# EAGLE schematic Audio_Board_REV_A (EAGLE 9.6.2)
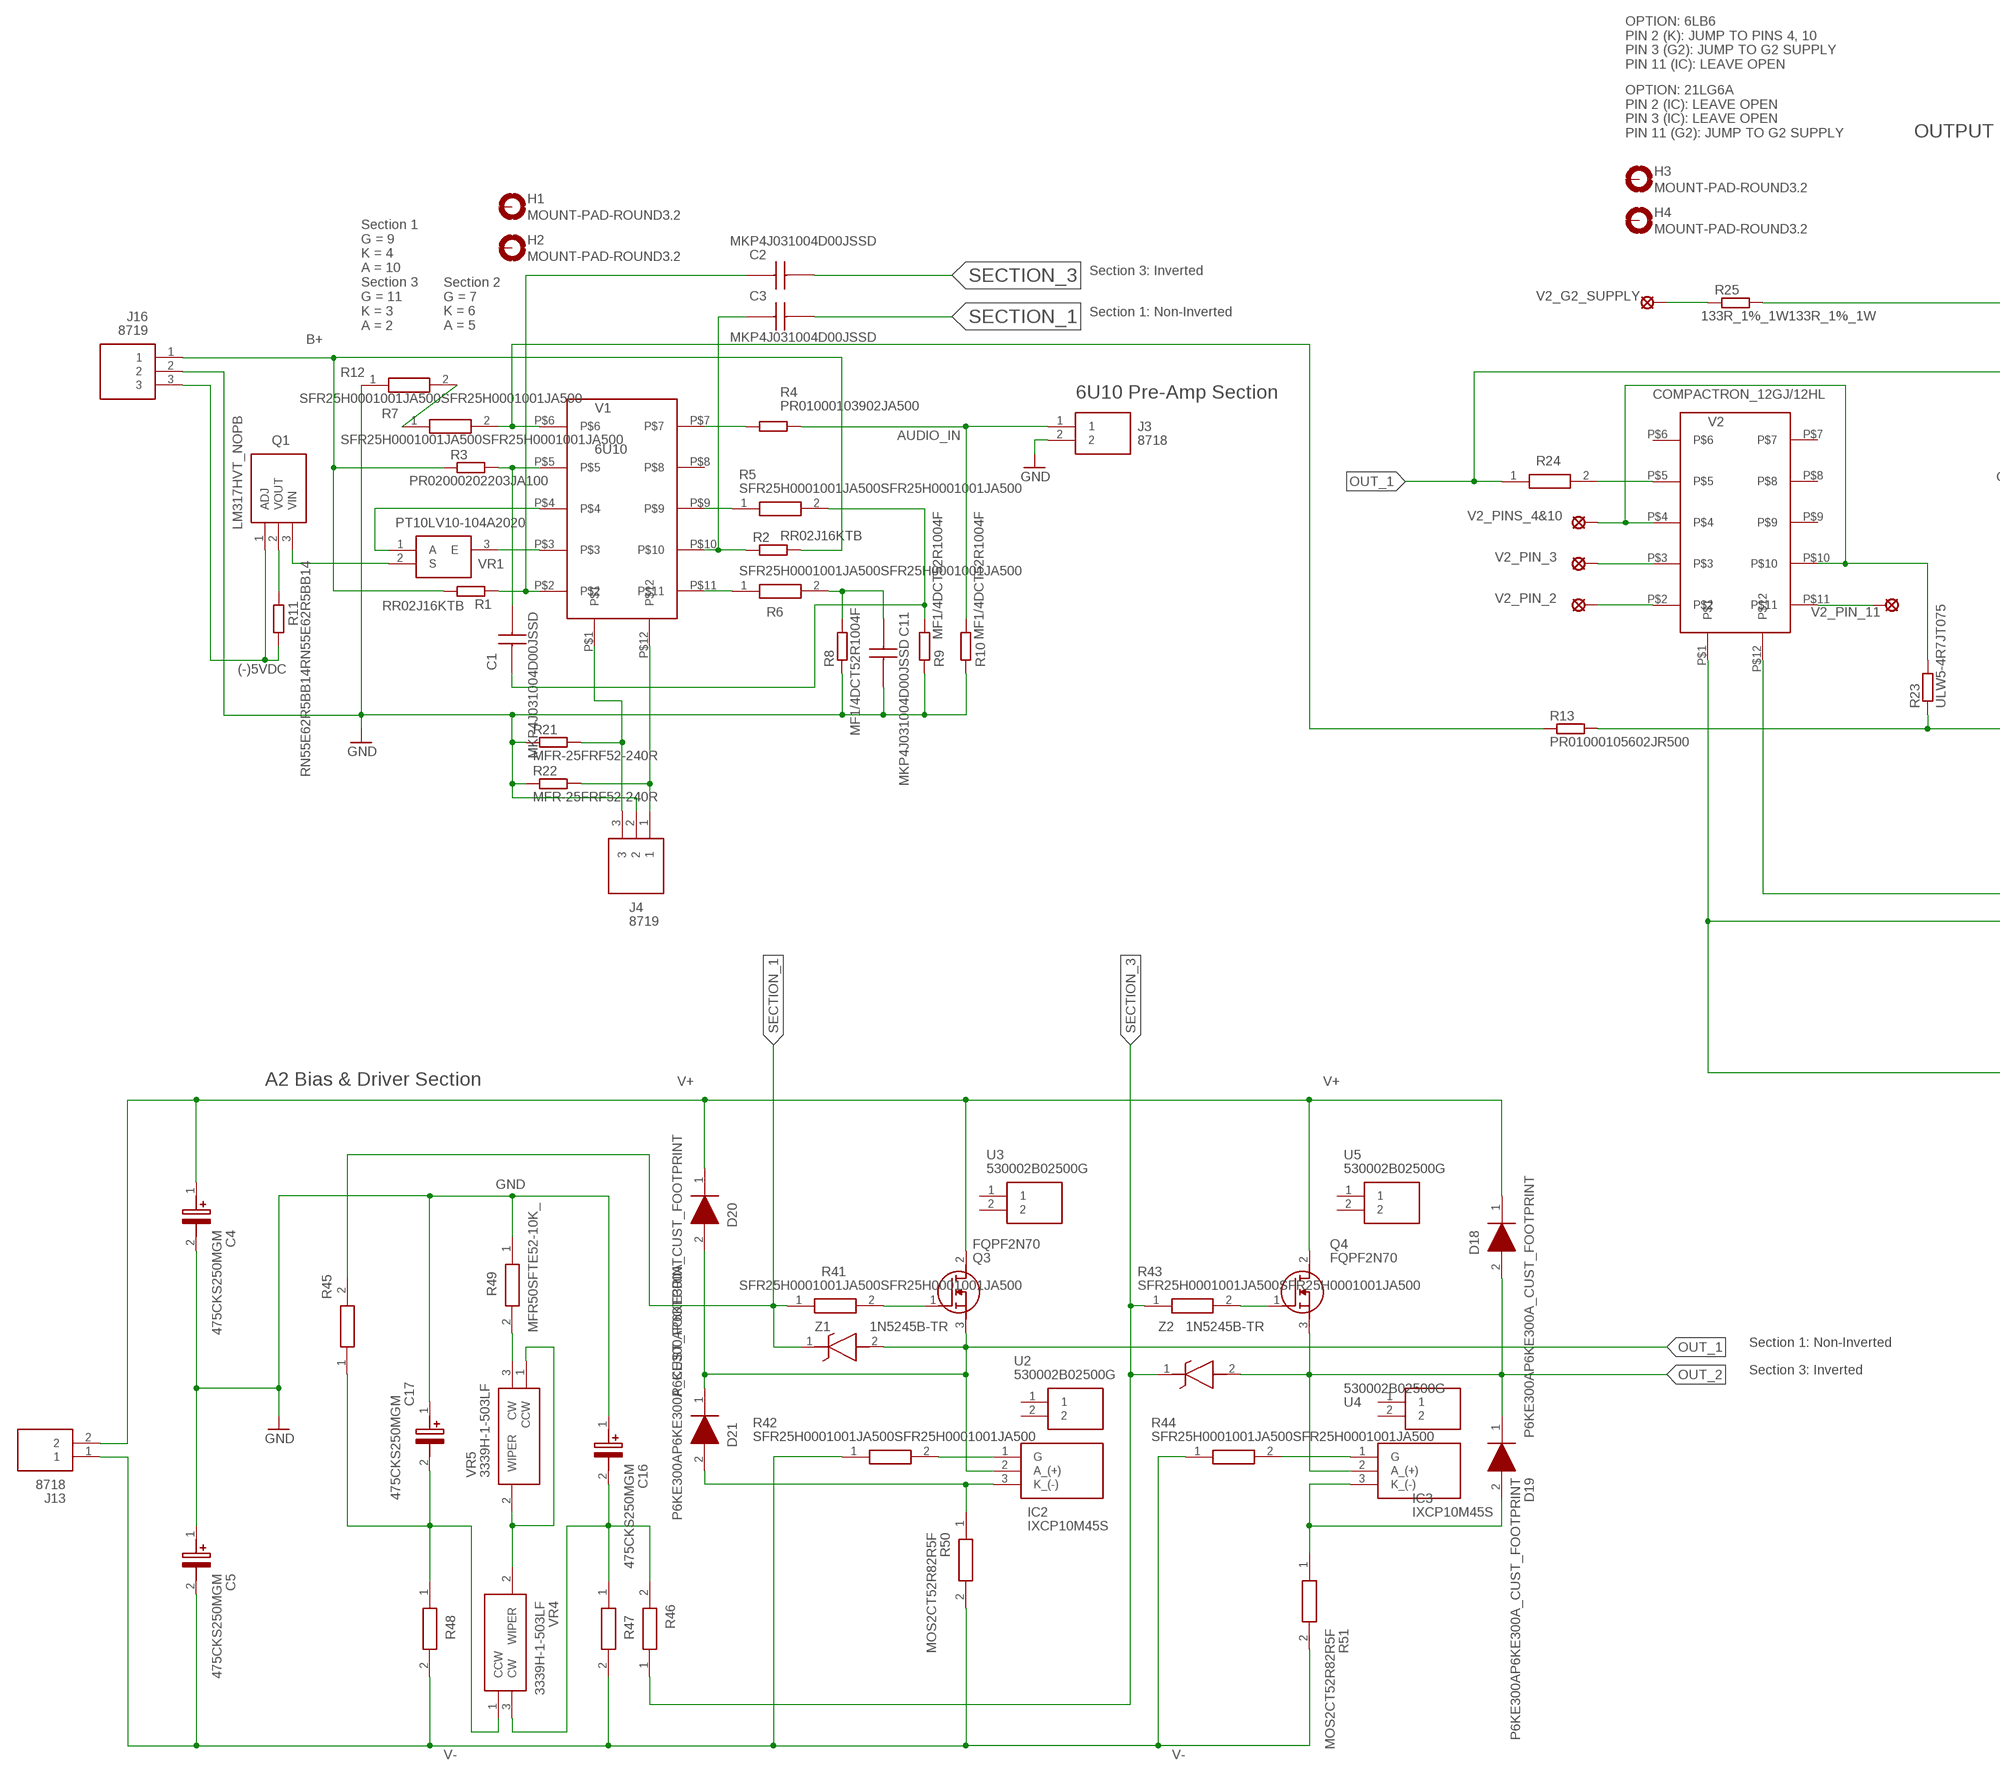
[diagram p0: schematic, sheet 1, part 1 of 2]
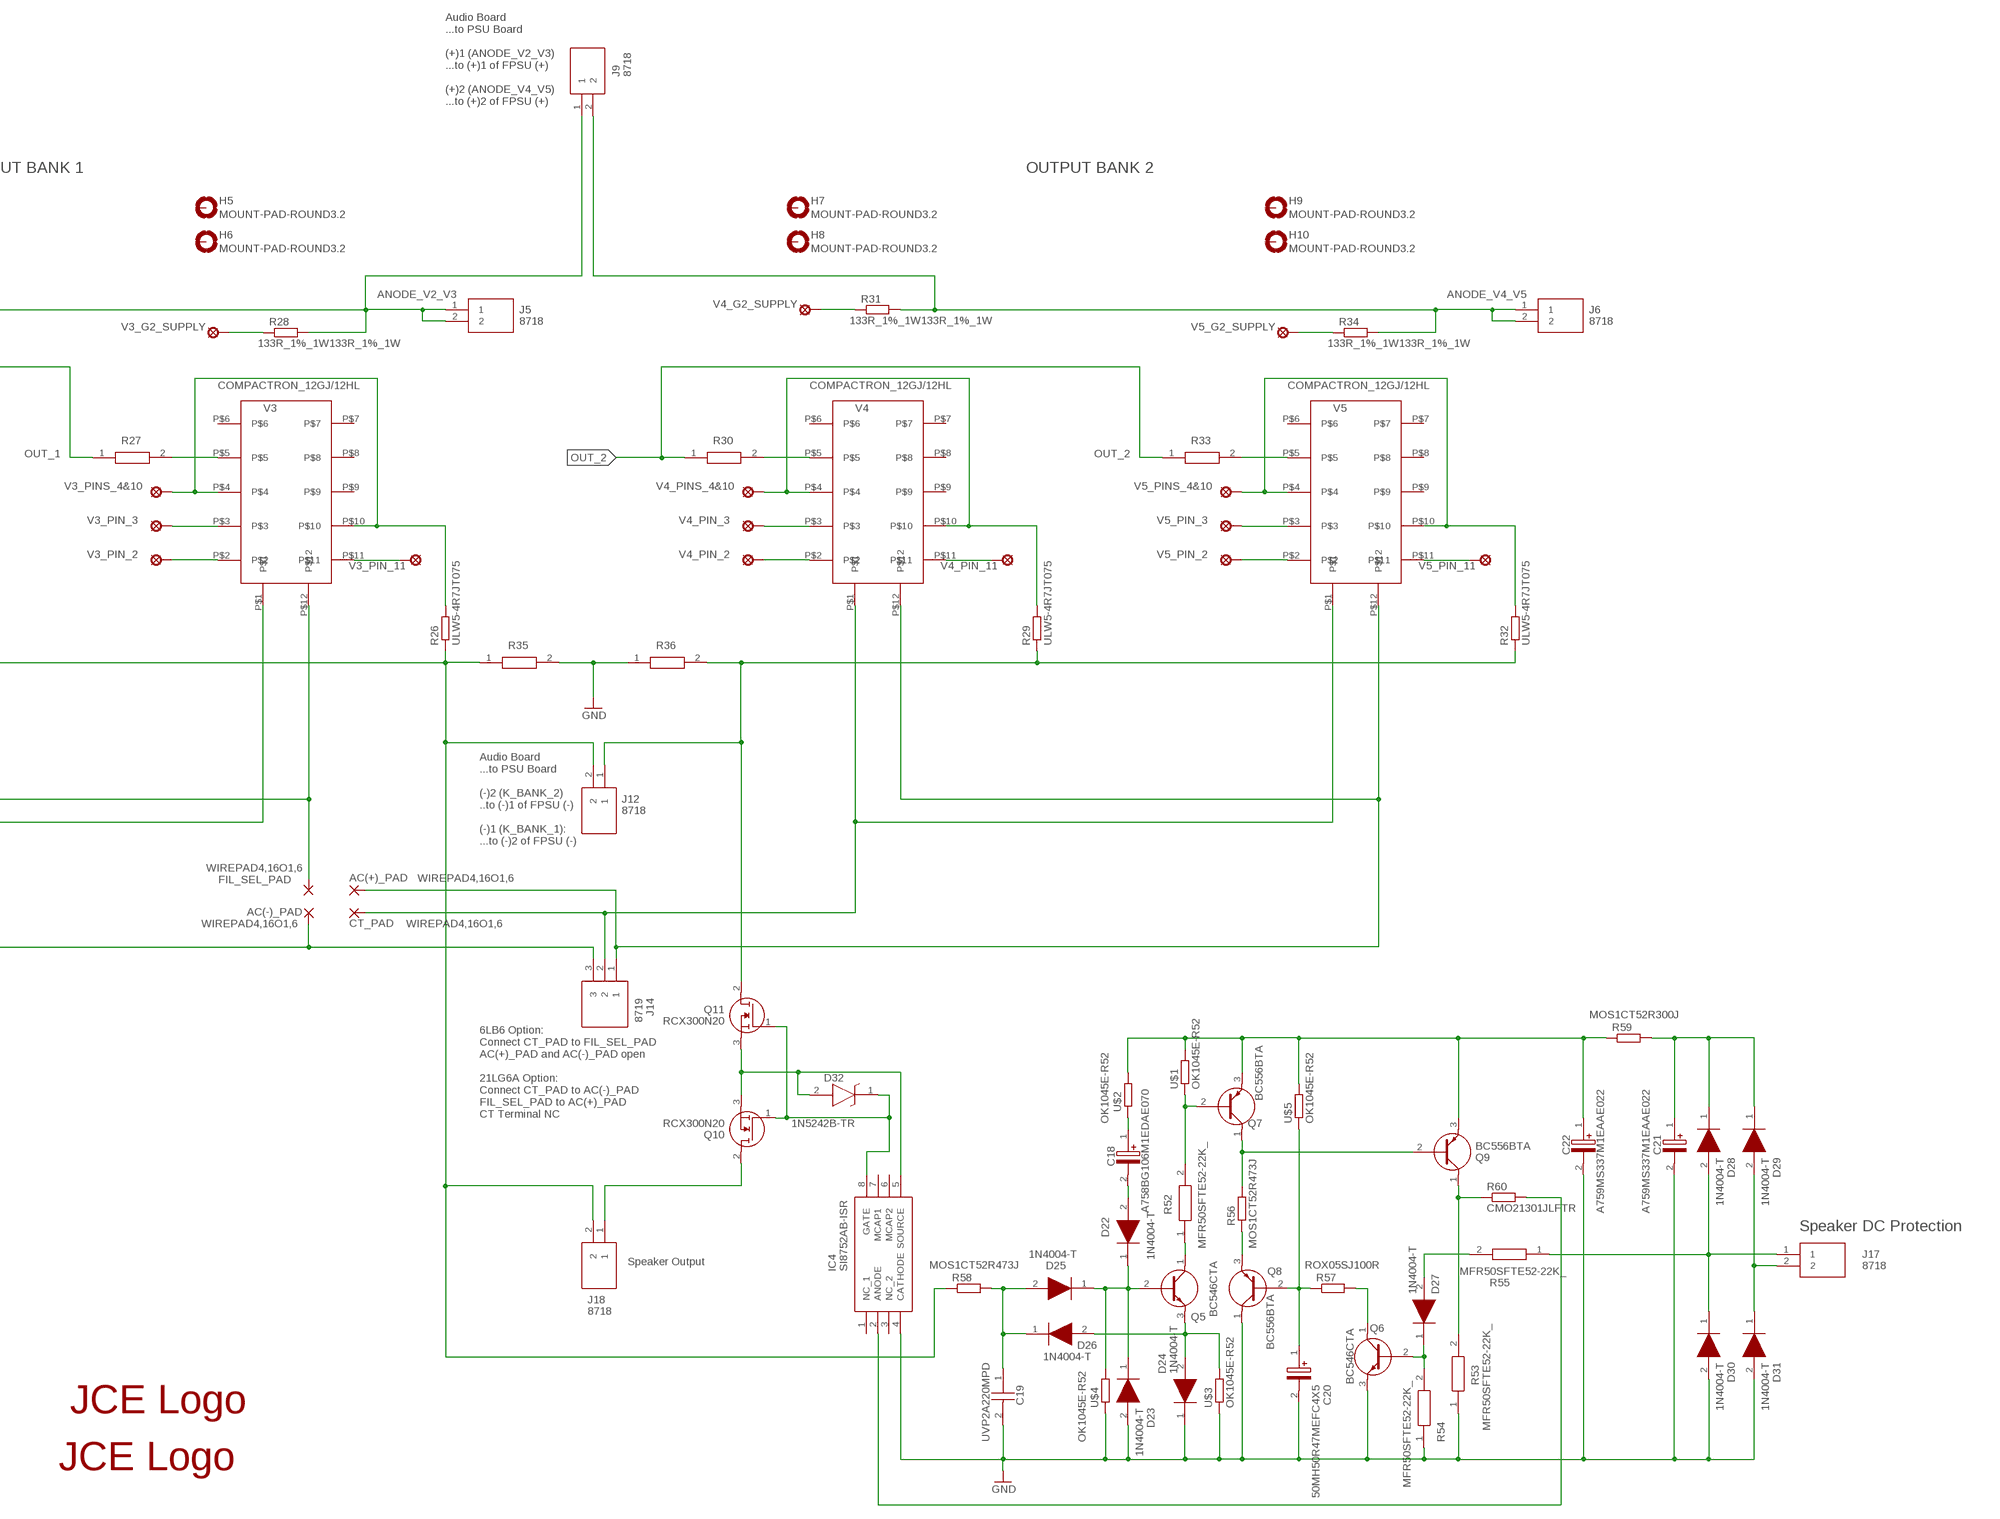
[diagram p1: schematic, sheet 1, part 2 of 2]

## Parts
AC(+)_PAD  WIREPAD4,16O1,6  [4,16O1,6]
AC(-)_PAD  WIREPAD4,16O1,6  [4,16O1,6]
C1  MKP4J031004D00JSSD  [MKP4J031004D00_]
C2  MKP4J031004D00JSSD  [MKP4J031004D00_]
C3  MKP4J031004D00JSSD  [MKP4J031004D00_]
C4  475CKS250MGM  [CAPPRD250W55D655H1250]
C5  475CKS250MGM  [CAPPRD250W55D655H1250]
C11  MKP4J031004D00JSSD  [MKP4J031004D00_]
C16  475CKS250MGM  [CAPPRD250W55D655H1250]
C17  475CKS250MGM  [CAPPRD250W55D655H1250]
C18  A758BG106M1EDAE070  [CAPPRD200W55D500H800]
C19  UVP2A220MPD  [CAPPRD500W60D1025H1750]
C20  50MH50R47MEFC4X5  [CAPPRD150W45D425H650]
C21  A759MS337M1EAAE022  [CAPPRD500W65D1000H1300]
C22  A759MS337M1EAAE022  [CAPPRD500W65D1000H1300]
CT_PAD  WIREPAD4,16O1,6  [4,16O1,6]
D18  P6KE300AP6KE300A_CUST_FOOTPRINT  [DIOAD1299W88L640D324B]
D19  P6KE300AP6KE300A_CUST_FOOTPRINT  [DIOAD1299W88L640D324B]
D20  P6KE300AP6KE300A_CUST_FOOTPRINT  [DIOAD1299W88L640D324B]
D21  P6KE300AP6KE300A_CUST_FOOTPRINT  [DIOAD1299W88L640D324B]
D22  1N4004-T  [DIOAD1408W86L464D236]
D23  1N4004-T  [DIOAD1408W86L464D236]
D24  1N4004-T  [DIOAD1408W86L464D236]
D25  1N4004-T  [DIOAD1408W86L464D236]
D26  1N4004-T  [DIOAD1408W86L464D236]
D27  1N4004-T  [DIOAD1408W86L464D236]
D28  1N4004-T  [DIOAD1408W86L464D236]
D29  1N4004-T  [DIOAD1408W86L464D236]
D30  1N4004-T  [DIOAD1408W86L464D236]
D31  1N4004-T  [DIOAD1408W86L464D236]
D32  1N5242B-TR  [DIOAD700W55L350D160B]
FIL_SEL_PAD  WIREPAD4,16O1,6  [4,16O1,6]
H1  MOUNT-PAD-ROUND3.2  [3,2-PAD]
H2  MOUNT-PAD-ROUND3.2  [3,2-PAD]
H3  MOUNT-PAD-ROUND3.2  [3,2-PAD]
H4  MOUNT-PAD-ROUND3.2  [3,2-PAD]
H5  MOUNT-PAD-ROUND3.2  [3,2-PAD]
H6  MOUNT-PAD-ROUND3.2  [3,2-PAD]
H7  MOUNT-PAD-ROUND3.2  [3,2-PAD]
H8  MOUNT-PAD-ROUND3.2  [3,2-PAD]
H9  MOUNT-PAD-ROUND3.2  [3,2-PAD]
H10  MOUNT-PAD-ROUND3.2  [3,2-PAD]
IC2  IXCP10M45S  [TO254P482X1016X2386-3P]
IC3  IXCP10M45S  [TO254P482X1016X2386-3P]
IC4  SI8752AB-ISR  [SOIC127P600X175-8N]
J3  8718  [SHDR2W99P0X500_1X2_1001X762X10]
J4  8719  [8719]
J5  8718  [SHDR2W99P0X500_1X2_1001X762X10]
J6  8718  [SHDR2W99P0X500_1X2_1001X762X10]
J9  8718  [SHDR2W99P0X500_1X2_1001X762X10]
J12  8718  [SHDR2W99P0X500_1X2_1001X762X10]
J13  8718  [SHDR2W99P0X500_1X2_1001X762X10]
J14  8719  [8719]
J16  8719  [8719]
J17  8718  [SHDR2W99P0X500_1X2_1001X762X10]
J18  8718  [SHDR2W99P0X500_1X2_1001X762X10]
Q1  LM317HVT_NOPB  [TO254P470X1028X1955-3P]
Q3  FQPF2N70  [TO254P490X1016X1977-3P]
Q4  FQPF2N70  [TO254P490X1016X1977-3P]
Q5  BC546CTA  [KA431AZTA]
Q6  BC546CTA  [KA431AZTA]
Q7  BC556BTA  [BC33740TA]
Q8  BC556BTA  [BC33740TA]
Q9  BC556BTA  [BC33740TA]
Q10  RCX300N20  [TO254P480X1010X1760-3P]
Q11  RCX300N20  [TO254P480X1010X1760-3P]
R1  RR02J16KTB  [RESAD1630W90L900D350B]
R2  RR02J16KTB  [RESAD1630W90L900D350B]
R3  PR02000202203JA100  [RESAD1809W83L1100D390B]
R4  PR01000103902JA500  [RESAD976W63L650D250B]
R5  SFR25H0001001JA500SFR25H0001001JA500  [RESAD1076W63L700D250B]
R6  SFR25H0001001JA500SFR25H0001001JA500  [RESAD1076W63L700D250B]
R7  SFR25H0001001JA500SFR25H0001001JA500  [RESAD1076W63L700D250B]
R8  MF1/4DCT52R1004F  [RESAD1000W60L630D230B]
R9  MF1/4DCT52R1004F  [RESAD1000W60L630D230B]
R10  MF1/4DCT52R1004F  [RESAD1000W60L630D230B]
R11  RN55E62R5BB14RN55E62R5BB14  [RESAD999W69L610D240B]
R12  SFR25H0001001JA500SFR25H0001001JA500  [RESAD1076W63L700D250B]
R13  PR01000105602JR500  [RESAD976W63L650D250B]
R21  MFR-25FRF52-240R  [RESAD1000W60L630D230B]
R22  MFR-25FRF52-240R  [RESAD1000W60L630D230B]
R23  ULW5-4R7JT075  [RESAD2010W80L1650D720B]
R24  SFR25H0001001JA500SFR25H0001001JA500  [RESAD1076W63L700D250B]
R25  133R_1%_1W133R_1%_1W  [RESAD1560W50L1230D250B]
R26  ULW5-4R7JT075  [RESAD2010W80L1650D720B]
R27  SFR25H0001001JA500SFR25H0001001JA500  [RESAD1076W63L700D250B]
R28  133R_1%_1W133R_1%_1W  [RESAD1560W50L1230D250B]
R29  ULW5-4R7JT075  [RESAD2010W80L1650D720B]
R30  SFR25H0001001JA500SFR25H0001001JA500  [RESAD1076W63L700D250B]
R31  133R_1%_1W133R_1%_1W  [RESAD1560W50L1230D250B]
R32  ULW5-4R7JT075  [RESAD2010W80L1650D720B]
R33  SFR25H0001001JA500SFR25H0001001JA500  [RESAD1076W63L700D250B]
R34  133R_1%_1W133R_1%_1W  [RESAD1560W50L1230D250B]
R35  SFR25H0001001JA500SFR25H0001001JA500  [RESAD1076W63L700D250B]
R36  SFR25H0001001JA500SFR25H0001001JA500  [RESAD1076W63L700D250B]
R41  SFR25H0001001JA500SFR25H0001001JA500  [RESAD1076W63L700D250B]
R42  SFR25H0001001JA500SFR25H0001001JA500  [RESAD1076W63L700D250B]
R43  SFR25H0001001JA500SFR25H0001001JA500  [RESAD1076W63L700D250B]
R44  SFR25H0001001JA500SFR25H0001001JA500  [RESAD1076W63L700D250B]
R45  MFR50SFTE52-220K_  [RESAD1276W63L900D330B]
R46  MFR50SFTE52-220K_  [RESAD1276W63L900D330B]
R47  MFR50SFTE52-220K_  [RESAD1276W63L900D330B]
R48  MFR50SFTE52-220K_  [RESAD1276W63L900D330B]
R49  MFR50SFTE52-10K_  [RESAD1276W63L900D330B]
R50  MOS2CT52R82R5F  [RESAD1660W80L1200D400B]
R51  MOS2CT52R82R5F  [RESAD1660W80L1200D400B]
R52  MFR50SFTE52-22K_  [RESAD1276W63L900D330B]
R53  MFR50SFTE52-22K_  [RESAD1276W63L900D330B]
R54  MFR50SFTE52-22K_  [RESAD1276W63L900D330B]
R55  MFR50SFTE52-22K_  [RESAD1276W63L900D330B]
R56  MOS1CT52R473J  [RESAD1360W80L900D300B]
R57  ROX05SJ100R  [RESAD1350W75L1000D350B]
R58  MOS1CT52R473J  [RESAD1360W80L900D300B]
R59  MOS1CT52R300J  [RESAD1360W80L900D300B]
R60  CMO21301JLFTR  [ON1045E-R58]
SYM1  JCE_SMALLSMALL  [JCE_SMALL]
SYM2  JCE_SMALL  [JCE]
U2  530002B02500G  [529802B02500G]
U3  530002B02500G  [529802B02500G]
U4  530002B02500G  [529802B02500G]
U5  530002B02500G  [529802B02500G]
U$1  OK1045E-R52  [RESAD1020W70L680D250B]
U$2  OK1045E-R52  [RESAD1020W70L680D250B]
U$3  OK1045E-R52  [RESAD1020W70L680D250B]
U$4  OK1045E-R52  [RESAD1020W70L680D250B]
U$5  OK1045E-R52  [RESAD1020W70L680D250B]
V1  6U10  [6U10]
V2  COMPACTRON_12GJ/12HL  [6U10]
V2_G2_SUPPLY  LSP13  [LSP13]
V2_PIN_2  LSP13  [LSP13]
V2_PIN_3  LSP13  [LSP13]
V2_PIN_11  LSP13  [LSP13]
V2_PINS_4&10  LSP13  [LSP13]
V3  COMPACTRON_12GJ/12HL  [6U10]
V3_G2_SUPPLY  LSP13  [LSP13]
V3_PIN_2  LSP13  [LSP13]
V3_PIN_3  LSP13  [LSP13]
V3_PIN_11  LSP13  [LSP13]
V3_PINS_4&10  LSP13  [LSP13]
V4  COMPACTRON_12GJ/12HL  [6U10]
V4_G2_SUPPLY  LSP13  [LSP13]
V4_PIN_2  LSP13  [LSP13]
V4_PIN_3  LSP13  [LSP13]
V4_PIN_11  LSP13  [LSP13]
V4_PINS_4&10  LSP13  [LSP13]
V5  COMPACTRON_12GJ/12HL  [6U10]
V5_G2_SUPPLY  LSP13  [LSP13]
V5_PIN_2  LSP13  [LSP13]
V5_PIN_3  LSP13  [LSP13]
V5_PIN_11  LSP13  [LSP13]
V5_PINS_4&10  LSP13  [LSP13]
VR1  PT10LV10-104A2020  [PT10LV10]
VR4  3339H-1-503LF  [3339H1253LF]
VR5  3339H-1-503LF  [3339H1253LF]
Z1  1N5245B-TR  [DIOAD990W55L350D160]
Z2  1N5245B-TR  [DIOAD990W55L350D160]

## Nets
6.3VAC_H1: J4.1 R22.2 V1.P$12
6.3VAC_H24: J4.3 R21.2 V1.P$1
(-)5VDC: J16.3 Q1.1(ADJ) R11.1
A1: IC4.2(ANODE) R60.2
ANODE_V2_V3: J5.1 J5.2 J9.1 R25.2 R28.2
ANODE_V4_V5: J6.1 J6.2 J9.2 R31.2 R34.2
AUDIO_IN: J3.1 R4.2 R10.2
B+: J16.1 R1.2 R2.2 R3.1
FIL_AC(+): AC(+)_PAD.1(P) J14.1 V4.P$12 V5.P$12
FIL_AC(-): AC(-)_PAD.1(P) J14.3 V2.P$1 V3.P$1
FIL_CT: CT_PAD.1(P) J14.2 V4.P$1 V5.P$1
FIL_SEL: FIL_SEL_PAD.1(P) V2.P$12 V3.P$12
GND: C4.2(-) C5.1(+) C11.P$2 C16.1(+) C17.1(+) C19.2(-) C20.2(-) C21.2(-) C22.2(-) D23.2(A) D24.1(K) D30.2(A) D31.2(A) IC4.4(CATHODE) J3.2 J4.2 J16.2 Q6.3(E) Q8.1(C) R8.1 R9.1 R10.1 R12.1 R21.1 R22.1 R35.2 R36.1 R49.1 R53.1 R54.1 U$3.1 U$4.1
K_BANK_1: J12.2 J18.2 R13.2 R23.1 R26.1 R35.1 R58.1
K_BANK_2: J12.1 Q11.2(D) R29.1 R32.1 R36.2
K_BANK_2': J18.1 Q10.2(D)
N$1: R7.1 R12.2
N$11: Q1.3(VIN) VR1.2(S)
N$12: Q1.2(VOUT) R11.2
N$14: C1.P$2 R5.2 R9.2
N$15: C11.P$1 R6.2 R8.2
N$26: V2.P$2 V2_PIN_2.MP
N$27: V2.P$3 V2_PIN_3.MP
N$28: V2.P$11 V2_PIN_11.MP
N$30: R24.2 V2.P$5
N$31: Q7.2(B) R52.2 U$1.1
N$34: Q5.1(C) R52.1
N$35: V3.P$2 V3_PIN_2.MP
N$36: V3.P$3 V3_PIN_3.MP
N$37: V3.P$11 V3_PIN_11.MP
N$39: R27.2 V3.P$5
N$40: C22.1(+) Q7.3(E) Q9.3(E) R59.1 U$1.2 U$2.2 U$5.2
N$41: V4.P$2 V4_PIN_2.MP
N$43: V4.P$3 V4_PIN_3.MP
N$44: V4.P$11 V4_PIN_11.MP
N$46: R30.2 V4.P$5
N$47: C18.1(+) U$2.1
N$48: C18.2(-) D22.2(A)
N$50: D22.1(K) D23.1(K) D25.1(K) Q5.2(B) U$4.2
N$51: V5.P$2 V5_PIN_2.MP
N$52: V5.P$3 V5_PIN_3.MP
N$53: V5.P$11 V5_PIN_11.MP
N$55: R33.2 V5.P$5
N$57: D24.2(A) D26.2(A) Q5.3(E) U$3.2
N$59: C19.1(+) D25.2(A) D26.1(K) R58.2
N$60: Q3.1(G) R41.2
N$64: IC2.1(G) R42.2
N$67: D21.2(A) IC2.3(K_(-)) R50.1
N$68: D19.2(A) IC3.3(K_(-)) R51.1
N$69: IC3.1(G) R44.2
N$70: C20.1(+) Q8.2(B) R57.1 U$5.1
N$71: Q7.1(C) Q9.2(B) R56.2
N$72: Q4.1(G) R43.2
N$73: C17.2(-) R45.1 R48.1 VR4.1(CCW)
N$74: C16.2(-) R46.2 R47.1 VR4.3(CW)
N$75: R49.2 VR5.3(CW)
N$76: VR4.2(WIPER) VR5.1(CCW) VR5.2(WIPER)
N$77: Q9.1(C) R53.2 R60.1
N$78: D27.1(K) Q6.2(B) R54.2
N$79: D27.2(A) R55.2
N$80: Q8.3(E) R56.1
N$81: Q6.1(C) R57.2
N$82: D28.2(A) D30.1(K) J17.1 R55.1
N$83: D29.2(A) D31.1(K) J17.2
N$84: C21.1(+) D28.1(K) D29.1(K) R59.2
N$85: D32.2(A) IC4.5(SOURCE) Q10.3(S) Q11.3(S)
N$86: D32.1(K) IC4.8(GATE) Q10.1(G) Q11.1(G)
OUT_1: D20.2(A) D21.1(K) IC2.2(A_(+)) Q3.3(S) R24.1 R27.1 Z1.2(A)
OUT_2: D18.2(A) D19.1(K) IC3.2(A_(+)) Q4.3(S) R30.1 R33.1 Z2.2(A)
S1_A: C3.P$2 R2.1 V1.P$10
S1_G: R5.1 V1.P$9
S1_K: V1.P$4 VR1.1(A)
S2_A: C1.P$1 R3.2 V1.P$5
S2_G: R4.1 V1.P$7
S2_K: R7.2 R13.1 V1.P$6
S3_A: C2.P$2 R1.1 V1.P$2
S3_G: R6.1 V1.P$11
S3_K: V1.P$3 VR1.3(E)
SECTION_1: C3.P$1 R41.1 R45.2 Z1.1(K)
SECTION_3: C2.P$1 R43.1 R46.1 Z2.1(K)
V2_G2: R25.1 V2_G2_SUPPLY.MP
V2_K: R23.2 V2.P$4 V2.P$10 V2_PINS_4&10.MP
V3_G2: R28.1 V3_G2_SUPPLY.MP
V3_K: R26.2 V3.P$4 V3.P$10 V3_PINS_4&10.MP
V4_G2: R31.1 V4_G2_SUPPLY.MP
V4_K: R29.2 V4.P$4 V4.P$10 V4_PINS_4&10.MP
V5_G2: R34.1 V5_G2_SUPPLY.MP
V5_K: R32.2 V5.P$4 V5.P$10 V5_PINS_4&10.MP
V+: C4.1(+) D18.1(K) D20.1(K) J13.2 Q3.2(D) Q4.2(D)
V-: C5.2(-) J13.1 R42.1 R44.1 R47.2 R48.2 R50.2 R51.2
Unconnected: H1.B3,2(MOUNT) H2.B3,2(MOUNT) H3.B3,2(MOUNT) H4.B3,2(MOUNT) H5.B3,2(MOUNT) H6.B3,2(MOUNT) H7.B3,2(MOUNT) H8.B3,2(MOUNT) H9.B3,2(MOUNT) H10.B3,2(MOUNT) IC4.1(NC_1) IC4.3(NC_2) IC4.6(MCAP2) IC4.7(MCAP1) U2.1 U2.2 U3.1 U3.2 U4.1 U4.2 U5.1 U5.2 V1.P$8 V2.P$6 V2.P$7 V2.P$8 V2.P$9 V3.P$6 V3.P$7 V3.P$8 V3.P$9 V4.P$6 V4.P$7 V4.P$8 V4.P$9 V5.P$6 V5.P$7 V5.P$8 V5.P$9

## Notes on the sheet
- Audio Board
  ...to PSU Board
  
  (+)1 (ANODE_V2_V3)
  ...to (+)1 of FPSU (+)
  
  (+)2 (ANODE_V4_V5)
  ...to (+)2 of FPSU (+)
- OPTION: 6LB6
  PIN 2 (K): JUMP TO PINS 4, 10
  PIN 3 (G2): JUMP TO G2 SUPPLY
  PIN 11 (IC): LEAVE OPEN
- OPTION: 21LG6A
  PIN 2 (IC): LEAVE OPEN
  PIN 3 (IC): LEAVE OPEN
  PIN 11 (G2): JUMP TO G2 SUPPLY
- OUTPUT BANK 1 | OUTPUT BANK 2
- Section 3: Inverted
- Section 1: Non-Inverted
- Section 1
  G = 9
  K = 4
  A = 10
  Section 3
  G = 11
  K = 3
  A = 2
- Section 2
  G = 7
  K = 6
  A = 5
- 6U10 Pre-Amp Section
- Audio Board
  ...to PSU Board
  
  (-)2 (K_BANK_2)
  ..to (-)1 of FPSU (-)
  
  (-)1 (K_BANK_1): 
  ...to (-)2 of FPSU (-)
- A2 Bias & Driver Section
- 6LB6 Option: 
  Connect CT_PAD to FIL_SEL_PAD
  AC(+)_PAD and AC(-)_PAD open
  
  21LG6A Option:
  Connect CT_PAD to AC(-)_PAD
  FIL_SEL_PAD to AC(+)_PAD
  CT Terminal NC
- Section 1: Non-Inverted
- Section 3: Inverted
- Speaker DC Protection
- Speaker Output

## Library data of the parts
AC(+)_PAD AC(-)_PAD CT_PAD FIL_SEL_PAD = wirepad:WIREPAD: Wire PAD connect wire on PCB
C1-C3 C11 = SamacSys_Parts:MKP4J031004D00JSSD: WIMA Film Capacitors 630V 0.1uF 5%
C4 C5 C16 C17 = SamacSys_Parts:475CKS250MGM: Aluminium Electrolytic Capacitors - Radial Leaded 4.7uF 250V 20% tol ELECTROLYTIC For A2 driver board Source: Datasheet; DESCRIPTION: Aluminium Electrolytic Capacitors - Radial Leaded 4.7uF 250V 20% tol ELECTROLYTIC For A2 driver board; HEIGHT: 12.5mm; MANUFACTURER_NAME: Cornell Dubilier; MANUFACTURER_PART_NUMBER: 475CKS250MGM
C18 = SamacSys_Parts:A758BG106M1EDAE070: Aluminum Organic Polymer Capacitors 25V 10uF 20% ESR= 70mohms Source: Datasheet <https://api.kemet.com/component-edge/download/datasheet/A758BG106M1EDAE070.pdf>; DESCRIPTION: Aluminum Organic Polymer Capacitors 25V 10uF 20% ESR= 70mohms; HEIGHT: 8mm; MANUFACTURER_NAME: Kemet; MANUFACTURER_PART_NUMBER: A758BG106M1EDAE070; MOUSER_PART_NUMBER: 80-A758BG106M1EDAE70; MOUSER_PRICE-STOCK: https://www.mouser.co.uk/ProductDetail/KEMET/A758BG106M1EDAE070?qs=hzBznG4dWXUYIEcEuNBy%252BQ%3D%3D
C19 = SamacSys_Parts:UVP2A220MPD: Cap Aluminum Lytic 22uF 100V 20% (10 X 16mm) Radial 5mm 135mA 2000h 85C Automotive Bulk Source: Datasheet <https://www.arrow.com/en/products/uvp2a220mpd/nichicon>; DESCRIPTION: Cap Aluminum Lytic 22uF 100V 20% (10 X 16mm) Radial 5mm 135mA 2000h 85C Automotive Bulk; HEIGHT: 17.5mm; MANUFACTURER_NAME: Nichicon; MANUFACTURER_PART_NUMBER: UVP2A220MPD
C20 = SamacSys_Parts:50MH50R47MEFC4X5: Aluminium Electrolytic Capacitors - Radial Leaded GENERAL PURPOSE 5MM HEIGHT ELECTROLYTIC Source: Datasheet; DESCRIPTION: Aluminium Electrolytic Capacitors - Radial Leaded GENERAL PURPOSE 5MM HEIGHT ELECTROLYTIC; HEIGHT: 6.5mm; MANUFACTURER_NAME: Rubycon; MANUFACTURER_PART_NUMBER: 50MH50R47MEFC4X5
C21 C22 = SamacSys_Parts:A759MS337M1EAAE022: Aluminium Organic Polymer Capacitors 25V 330uF 20% ESR=22mOhms Source: Datasheet <https://www.mouser.com/datasheet/2/212/KEM_A4072_A759-1104329.pdf>; DESCRIPTION: Aluminium Organic Polymer Capacitors 25V 330uF 20% ESR=22mOhms; HEIGHT: 13mm; MANUFACTURER_NAME: Kemet; MANUFACTURER_PART_NUMBER: A759MS337M1EAAE022
D18-D21 = SamacSys_Parts:P6KE300A: TVS Diode Uni-Directional P6KE300A 529V, 600W, DO-15 2-Pin Source: Datasheet <http://www.st.com/web/en/resource/technical/document/datasheet/CD00000720.pdf>
D22-D31 = SamacSys_Parts:1N4004-T: Diodes Inc 400V 1A, Diode, 2-Pin DO-41 1N4004-T Source: Datasheet <https://www.diodes.com/assets/Datasheets/ds28002.pdf>; DESCRIPTION: Diodes Inc 400V 1A, Diode, 2-Pin DO-41 1N4004-T; HEIGHT: mm; MANUFACTURER_NAME: Diodes Inc.; MANUFACTURER_PART_NUMBER: 1N4004-T; MOUSER_PART_NUMBER: 621-1N4004; MOUSER_PRICE-STOCK: https://www.mouser.co.uk/ProductDetail/Diodes-Incorporated/1N4004-T/?qs=e%2FRqmsgwm9h5YfUmULbvEw%3D%3D
D32 = SamacSys_Parts:1N5242B-TR: Zener Diodes 12 Volt 0.5 Watt
H1-H10 = holes:MOUNT-PAD-ROUND: MOUNTING PAD, round
IC2 IC3 = SamacSys_Parts:IXCP10M45S: Current & Power Monitors & Regulators 450V 0.01A Source: Datasheet; DESCRIPTION: Current & Power Monitors & Regulators 450V 0.01A; HEIGHT: 4.82mm; MANUFACTURER_NAME: IXYS SEMICONDUCTOR; MANUFACTURER_PART_NUMBER: IXCP10M45S; MOUSER_PART_NUMBER: 747-IXCP10M45S; MOUSER_PRICE-STOCK: https://www.mouser.co.uk/ProductDetail/IXYS/IXCP10M45S?qs=AzHdteqROtlvGlo63LsvIA%3D%3D
IC4 = SamacSys_Parts:SI8752AB-ISR: SILICON LABS - SI8752AB-ISR - FET Driver, Isolated, 30 mA Input, LED Emulation, 194 kOhm Gate On, 15 s Turn Off, SOIC-8 Source: Datasheet <https://www.silabs.com/documents/public/data-sheets/Si8751-2.pdf>; DESCRIPTION: SILICON LABS - SI8752AB-ISR - FET Driver, Isolated, 30 mA Input, LED Emulation, 194 kOhm Gate On, 15 s Turn Off, SOIC-8; HEIGHT: 1.75mm; MANUFACTURER_NAME: Silicon Labs; MANUFACTURER_PART_NUMBER: SI8752AB-ISR; MOUSER_PART_NUMBER: 634-SI8752AB-ISR; MOUSER_PRICE-STOCK: https://www.mouser.co.uk/ProductDetail/Silicon-Labs/SI8752AB-ISR/?qs=j6MGy4L9yX3Sm319at6yMA%3D%3D
J3 J5 J6 J9 J12 J13 J17 J18 = SamacSys_Parts:8718: Fixed Terminal Blocks HORIZ. TERM. BLOCK Source: Datasheet <https://www.keyelco.com/product-pdf.cfm?p=14160>; DESCRIPTION: Fixed Terminal Blocks HORIZ. TERM. BLOCK; HEIGHT: 10.01mm; MANUFACTURER_NAME: Keystone Electronics; MANUFACTURER_PART_NUMBER: 8718; MOUSER_PART_NUMBER: 534-8718; MOUSER_PRICE-STOCK: https://www.mouser.co.uk/ProductDetail/Keystone-Electronics/8718?qs=%252BS1bAMbChF8qBANams%2FR5Q%3D%3D
J4 J14 J16 = SamacSys_Parts:8719: Fixed Terminal Blocks HORZ TERM BLK Source: Datasheet; DESCRIPTION: Fixed Terminal Blocks HORZ TERM BLK; HEIGHT: 10mm; MANUFACTURER_NAME: Keystone Electronics; MANUFACTURER_PART_NUMBER: 8719; MOUSER_PART_NUMBER: 534-8719; MOUSER_PRICE-STOCK: https://www.mouser.co.uk/ProductDetail/Keystone-Electronics/8719?qs=%252BS1bAMbChF9%2FI%252B6OdjWLaA%3D%3D
Q1 = SamacSys_Parts:LM317HVT_NOPB: Texas Instruments LM317 LM317HVT/NOPB, Single Linear Voltage Regulator, 1.5A Adjustable 1.2 57 V, 3-Pin TO-220 Source: Datasheet; DESCRIPTION: Texas Instruments LM317 LM317HVT/NOPB, Single Linear Voltage Regulator, 1.5A Adjustable 1.2 57 V, 3-Pin TO-220; HEIGHT: 4.7mm; MANUFACTURER_NAME: Texas Instruments; MANUFACTURER_PART_NUMBER: LM317HVT/NOPB; MOUSER_PART_NUMBER: 926-LM317HVT/NOPB; MOUSER_PRICE-STOCK: https://www.mouser.co.uk/ProductDetail/Texas-Instruments/LM317HVT-NOPB/?qs=X1J7HmVL2ZFyvDtHey14xA%3D%3D
Q3 Q4 = SamacSys_Parts:FQPF2N70: MOSFET 700V N-Channel Q-FET for A2 driver board Source: Datasheet; DESCRIPTION: MOSFET 700V N-Channel Q-FET for A2 driver board; HEIGHT: 4.9mm; MANUFACTURER_NAME: ON Semiconductor; MANUFACTURER_PART_NUMBER: FQPF2N70
Q5 Q6 = SamacSys_Parts:BC546CTA: Bipolar Transistors - BJT NPN 65V 100mA HFE/800 Source: Datasheet <https://media.digikey.com/pdf/Data Sheets/ON Semiconductor PDFs/BC546-50.pdf>; DESCRIPTION: Bipolar Transistors - BJT NPN 65V 100mA HFE/800; HEIGHT: 5.33mm; MANUFACTURER_NAME: ON Semiconductor; MANUFACTURER_PART_NUMBER: BC546CTA; MOUSER_PART_NUMBER: 512-BC546CTA; MOUSER_PRICE-STOCK: https://www.mouser.co.uk/ProductDetail/ON-Semiconductor-Fairchild/BC546CTA/?qs=WdhLxuNCrqKPeA561bEbDg%3D%3D
Q7-Q9 = SamacSys_Parts:BC556BTA: Transistor GP PNP 65V 0.1A TO92 Source: Datasheet <http://www.onsemi.com/pub/Collateral/BC556BTA-D.pdf>; DESCRIPTION: Transistor GP PNP 65V 0.1A TO92; HEIGHT: mm; MANUFACTURER_NAME: ON Semiconductor; MANUFACTURER_PART_NUMBER: BC556BTA; MOUSER_PART_NUMBER: 512-BC556BTA; MOUSER_PRICE-STOCK: https://www.mouser.co.uk/ProductDetail/ON-Semiconductor-Fairchild/BC556BTA?qs=MxR4l2%2FOSsClwwPLTEtiuw%3D%3D
Q10 Q11 = SamacSys_Parts:RCX300N20: RCX300N20 N-Channel MOSFET, 30 A, 200 V RCX300N20, 3-Pin TO-220FM ROHM Source: Datasheet; DESCRIPTION: RCX300N20 N-Channel MOSFET, 30 A, 200 V RCX300N20, 3-Pin TO-220FM ROHM; HEIGHT: 4.8mm; MANUFACTURER_NAME: ROHM Semiconductor; MANUFACTURER_PART_NUMBER: RCX300N20
R1 R2 = SamacSys_Parts:RR02J16KTB: Metal Film Resistors - Through Hole RR02 5% 16K AMMO
R3 = SamacSys_Parts:PR02000202203JA100: Metal Film Resistors - Through Hole 2watt 220Kohms 5%
R4 = SamacSys_Parts:PR01000103902JA500: Metal Film Resistors - Through Hole 1W 39Kohms 5%
R5-R7 R12 R24 R27 R30 R33 R35 R36 R41-R44 = SamacSys_Parts:SFR25H0001001JA500: RES 1K OHM 1/2W 5% AXIAL Source: Datasheet <http://www.vishay.com/docs/28722/sfr16s25.pdf>
R8-R10 = SamacSys_Parts:MF1/4DCT52R1004F: Metal Film Resistors - Through Hole 1/4W 1M ohm 1% 250V
R11 = SamacSys_Parts:RN55E62R5BB14: Metal Film Resistors - Through Hole 1/10watt 62.5ohms .1% 25ppm
R13 = SamacSys_Parts:PR01000105602JR500: Metal Film Resistors - Through Hole 1watt 56Kohms 5%
R21 R22 = SamacSys_Parts:MFR-25FRF52-240R: Metal Film Resistors - Through Hole 240 OHM 1/4W 1%
R23 R26 R29 R32 = SamacSys_Parts:ULW5-4R7JT075: Mouser #:756-ULW5-4R7JT075 Wirewound Resistors - Through Hole 5W 4.7 Ohm 5% FUSIBLE https://www.mouser.com/datasheet/2/414/TTRB_S_A0011519829_1-2565640.pdf
R25 R28 R31 R34 = SamacSys_Parts:133R_1%_1W
R45-R48 = SamacSys_Parts:MFR50SFTE52-220K: Metal Film Resistors - Through Hole 220K OHM 1/2W 1% For A2 driver board
R49 = SamacSys_Parts:MFR50SFTE52-10K: Metal Film Resistors - Through Hole 10K Ohms 1% 1/2 Watt Miniature Version
R50 R51 = SamacSys_Parts:MOS2CT52R82R5F: 82.5R 2W 1%
R52-R55 = SamacSys_Parts:MFR50SFTE52-22K: Metal Film Resistors - Through Hole 22K OHM 1/2W 1% For A2 driver board Source: Datasheet <https://ms.componentsearchengine.com/Datasheets/1/MFR50SFTE52-22K.pdf>
R56 R58 = SamacSys_Parts:MOS1CT52R473J: Metal Oxide Resistors 1W 47K 5%
R57 = SamacSys_Parts:ROX05SJ100R: Metal Oxide Resistors 1/2W SM M/OX 5% 100R
R59 = SamacSys_Parts:MOS1CT52R300J: Metal Oxide Resistors 1W 30 5%
R60 = SamacSys_Parts:CMO21301JLFTR: Metal Oxide Resistors 2W 1.3K ohm 5%
SYM1 SYM2 = SamacSys_Parts:JCE_SMALL
U2-U5 = SamacSys_Parts:530002B02500G: AAVID THERMALLOY - 530002B02500G - HEAT SINK, 2.6K/W, TO-220 Source: Datasheet <https://www.aavid.com/sites/default/files/products/boardlevel/aavid-standard-heatsinks.pdf>; DESCRIPTION: AAVID THERMALLOY - 530002B02500G - HEAT SINK, 2.6K/W, TO-220; HEIGHT: mm; MANUFACTURER_NAME: Aavid Thermalloy; MANUFACTURER_PART_NUMBER: 530002B02500G; MOUSER_PART_NUMBER: 532-530002B02500G; MOUSER_PRICE-STOCK: https://www.mouser.co.uk/ProductDetail/Aavid/530002B02500G/?qs=U7T%2FEnMyvTvnsUSILY5qjg%3D%3D
U$1-U$5 = SamacSys_Parts:OK1045E-R52: Carbon Film Resistors - Through Hole 100K Ohm 1/4W 5% 250 Volt Datasheet: Mouser <https://www.mouser.com/datasheet/2/303/res_little_rebel-1265497.pdf>
V1 = JErdy_Tube_Lib:6U10
V2-V5 = JErdy_Tube_Lib:COMPACTRON_12GJ/12HL: Generic compactron footprint intended for JEDEC 12GJ/12HL (6LB6/21LG6A)
V2_G2_SUPPLY V2_PIN_2 V2_PIN_3 V2_PIN_11 V2_PINS_4&10 V3_G2_SUPPLY V3_PIN_2 V3_PIN_3 V3_PIN_11 V3_PINS_4&10 V4_G2_SUPPLY V4_PIN_2 V4_PIN_3 V4_PIN_11 V4_PINS_4&10 V5_G2_SUPPLY V5_PIN_2 V5_PIN_3 V5_PIN_11 V5_PINS_4&10 = solpad:LSP13: SOLDER PAD drill 1.3 mm, distributor Buerklin, 12H562
VR1 = SamacSys_Parts:PT10LV10-104A2020: Trimmer Resistors - Through Hole 100ohms 10mm Rnd Top adj Source: Datasheet <https://www.mouser.com/datasheet/2/18/1/12_PT10v03-1499201.pdf>; DESCRIPTION: Trimmer Resistors - Through Hole 100ohms 10mm Rnd Top adj; HEIGHT: mm; MANUFACTURER_NAME: PIHER; MANUFACTURER_PART_NUMBER: PT10LV10-101A2020; MOUSER_PART_NUMBER: 531-PT10V-100; MOUSER_PRICE-STOCK: https://www.mouser.com/ProductDetail/531-PT10V-1009BK5dYp3wHA%3D%3D
VR4 VR5 = SamacSys_Parts:3339H-1-503LF: Trimmer Resistors - Through Hole 50K 5/16" Rnd 4Turn Cermet Source: Datasheet; DESCRIPTION: Trimmer Resistors - Through Hole 50K 5/16" Rnd 4Turn Cermet; HEIGHT: 6.6mm; MANUFACTURER_NAME: Bourns; MANUFACTURER_PART_NUMBER: 3339H-1-503LF; MOUSER_PART_NUMBER: 652-3339H-1-503LF; MOUSER_PRICE-STOCK: https://www.mouser.com/ProductDetail/652-3339H-1-503LF
Z1 Z2 = SamacSys_Parts:1N5245B-TR: Vishay 1N5245B-TR Zener Diode, 15V 5% 0.5 W Through Hole 2-Pin DO-35 Source: Datasheet; DESCRIPTION: Vishay 1N5245B-TR Zener Diode, 15V 5% 0.5 W Through Hole 2-Pin DO-35; HEIGHT: mm; MANUFACTURER_NAME: Vishay; MANUFACTURER_PART_NUMBER: 1N5245B-TR; MOUSER_PART_NUMBER: 78-1N5245B; MOUSER_PRICE-STOCK: https://www.mouser.co.uk/ProductDetail/Vishay-Semiconductors/1N5245B-TR?qs=TNTIDjy6APo%252BlQLkobTvQg%3D%3D